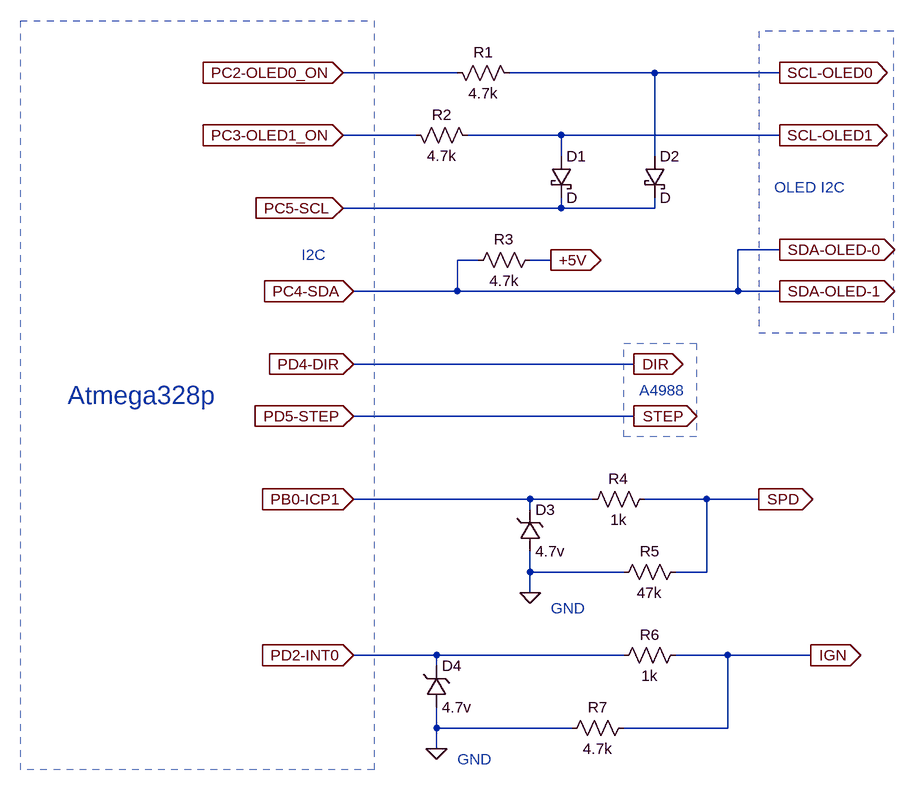
[diagram p0: schematic Схема.asc]
Схема.asc, the LTspice schematic file:
Version 4
SHEET 1 956 680
WIRE 256 -944 80 -944
WIRE 560 -944 336 -944
WIRE 752 -944 560 -944
WIRE 192 -848 80 -848
WIRE 416 -848 272 -848
WIRE 752 -848 416 -848
WIRE 416 -816 416 -848
WIRE 560 -816 560 -944
WIRE 416 -736 416 -752
WIRE 416 -736 80 -736
WIRE 560 -736 560 -752
WIRE 560 -736 416 -736
WIRE 752 -672 688 -672
WIRE 288 -656 256 -656
WIRE 400 -656 368 -656
WIRE 256 -608 256 -656
WIRE 256 -608 96 -608
WIRE 688 -608 688 -672
WIRE 688 -608 256 -608
WIRE 752 -608 688 -608
WIRE 528 -496 96 -496
WIRE 528 -416 96 -416
WIRE 368 -288 96 -288
WIRE 464 -288 368 -288
WIRE 640 -288 544 -288
WIRE 720 -288 640 -288
WIRE 368 -272 368 -288
WIRE 368 -176 368 -208
WIRE 512 -176 368 -176
WIRE 640 -176 640 -288
WIRE 640 -176 592 -176
WIRE 368 -144 368 -176
WIRE 224 -48 96 -48
WIRE 512 -48 224 -48
WIRE 672 -48 592 -48
WIRE 800 -48 672 -48
WIRE 224 -32 224 -48
WIRE 224 64 224 32
WIRE 432 64 224 64
WIRE 672 64 672 -48
WIRE 672 64 512 64
WIRE 224 96 224 64
FLAG 80 -736 PC5-SCL
IOPIN 80 -736 In
FLAG 96 -608 PC4-SDA
IOPIN 96 -608 In
FLAG 80 -848 PC3-OLED1_ON
IOPIN 80 -848 In
FLAG 80 -944 PC2-OLED0_ON
IOPIN 80 -944 In
FLAG 752 -672 SDA-OLED-0
IOPIN 752 -672 Out
FLAG 752 -608 SDA-OLED-1
IOPIN 752 -608 Out
FLAG 752 -848 SCL-OLED1
IOPIN 752 -848 Out
FLAG 752 -944 SCL-OLED0
IOPIN 752 -944 Out
FLAG 96 -496 PD4-DIR
IOPIN 96 -496 In
FLAG 96 -416 PD5-STEP
IOPIN 96 -416 In
FLAG 528 -496 DIR
IOPIN 528 -496 Out
FLAG 528 -416 STEP
IOPIN 528 -416 Out
FLAG 400 -656 +5V
IOPIN 400 -656 Out
FLAG 96 -288 PB0-ICP1
IOPIN 96 -288 In
FLAG 96 -48 PD2-INT0
IOPIN 96 -48 In
FLAG 368 -144 0
FLAG 720 -288 SPD
IOPIN 720 -288 Out
FLAG 800 -48 IGN
IOPIN 800 -48 Out
FLAG 224 96 0
SYMBOL schottky 400 -816 R0
SYMATTR InstName D1
SYMBOL schottky 544 -816 R0
SYMATTR InstName D2
SYMBOL res 240 -960 M90
WINDOW 0 0 56 VBottom 2
WINDOW 3 32 56 VTop 2
SYMATTR InstName R1
SYMATTR Value 4.7k
SYMBOL res 176 -864 M90
WINDOW 0 0 56 VBottom 2
WINDOW 3 32 56 VTop 2
SYMATTR InstName R2
SYMATTR Value 4.7k
SYMBOL res 384 -672 R90
WINDOW 0 0 56 VBottom 2
WINDOW 3 32 56 VTop 2
SYMATTR InstName R3
SYMATTR Value 4.7k
SYMBOL zener 352 -208 M180
WINDOW 0 24 64 Left 2
WINDOW 3 24 0 Left 2
SYMATTR InstName D3
SYMATTR Value 4.7v
SYMBOL res 560 -304 R90
WINDOW 0 0 56 VBottom 2
WINDOW 3 32 56 VTop 2
SYMATTR InstName R4
SYMATTR Value 1k
SYMBOL res 608 -192 R90
WINDOW 0 0 56 VBottom 2
WINDOW 3 32 56 VTop 2
SYMATTR InstName R5
SYMATTR Value 47k
SYMBOL res 608 -64 R90
WINDOW 0 0 56 VBottom 2
WINDOW 3 32 56 VTop 2
SYMATTR InstName R6
SYMATTR Value 1k
SYMBOL res 416 80 R270
WINDOW 0 32 56 VTop 2
WINDOW 3 0 56 VBottom 2
SYMATTR InstName R7
SYMATTR Value 4.7k
SYMBOL zener 208 32 M180
WINDOW 0 24 64 Left 2
WINDOW 3 24 0 Left 2
SYMATTR InstName D4
SYMATTR Value 4.7v
TEXT 16 -664 Left 2 ;I2C
TEXT -344 -448 Left 4 ;Atmega328p
TEXT 536 -456 Left 2 ;A4988
TEXT 744 -768 Left 2 ;OLED I2C
TEXT 400 -120 Left 2 ;GND
TEXT 256 112 Left 2 ;GND
RECTANGLE Normal 128 128 -416 -1024 2
RECTANGLE Normal 928 -1008 720 -544 2
RECTANGLE Normal 624 -384 512 -528 2

The netlist it stands for:
* Схема.asc
D1 SCL-OLED1 PC5-SCL D
D2 SCL-OLED0 PC5-SCL D
R1 PC2-OLED0_ON SCL-OLED0 4.7k
R2 PC3-OLED1_ON SCL-OLED1 4.7k
R3 +5V SDA-OLED-1 4.7k
D3 0 PB0-ICP1 4.7v
R4 SPD PB0-ICP1 1k
R5 SPD 0 47k
R6 IGN PD2-INT0 1k
R7 0 IGN 4.7k
D4 0 PD2-INT0 4.7v
.model D D
.lib standard.dio
* I2C
* Atmega328p
* A4988
* OLED I2C
* GND
* GND
.backanno
.end